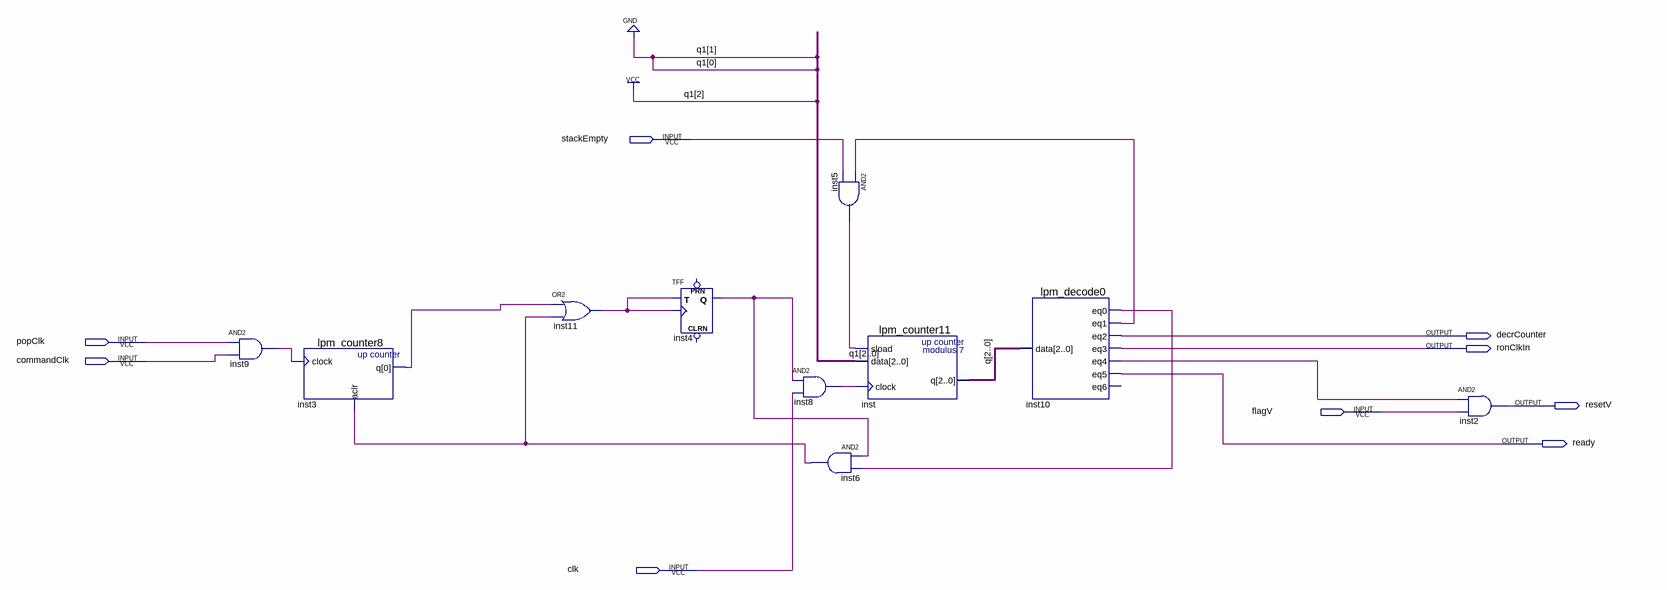
[diagram p0: schematic sheet]
// Quartus schematic pop.bdf as structural Verilog: 10 symbols, 9 pins
module pop (
  input  stackEmpty,
  input  popClk,
  input  commandClk,
  input  flagV,
  input  clk,
  output decrCounter,
  output ronClkIn,
  output resetV,
  output ready
);

  wire inst3_q, inst4_q, inst5_out, inst6_out, inst8_out, inst9_out, inst10_eq0, inst10_eq1, inst10_eq4,
       inst11_out;
  wire [2:0] q;

  and inst9 (inst9_out, popClk, commandClk);
  lpm_counter8 inst3 (.clock(inst9_out), .aclr(inst6_out), .q(inst3_q));
  or inst11 (inst11_out, inst3_q, inst6_out);
  TFF inst4 (.T(inst11_out), .CLK(inst11_out), .Q(inst4_q));  // open: PRN, CLRN
  and inst5 (inst5_out, inst10_eq1, stackEmpty);
  and inst8 (inst8_out, inst4_q, clk);
  and inst6 (inst6_out, inst4_q, inst10_eq0);
  lpm_counter11 inst (.sload(inst5_out), .data(3'b100), .clock(inst8_out), .q(q));
  lpm_decode0 inst10 (
    .data(q), .eq0(inst10_eq0), .eq1(inst10_eq1), .eq2(decrCounter), .eq3(ronClkIn), .eq4(inst10_eq4),
    .eq5(ready));  // open: eq6
  and inst2 (resetV, inst10_eq4, flagV);
endmodule
